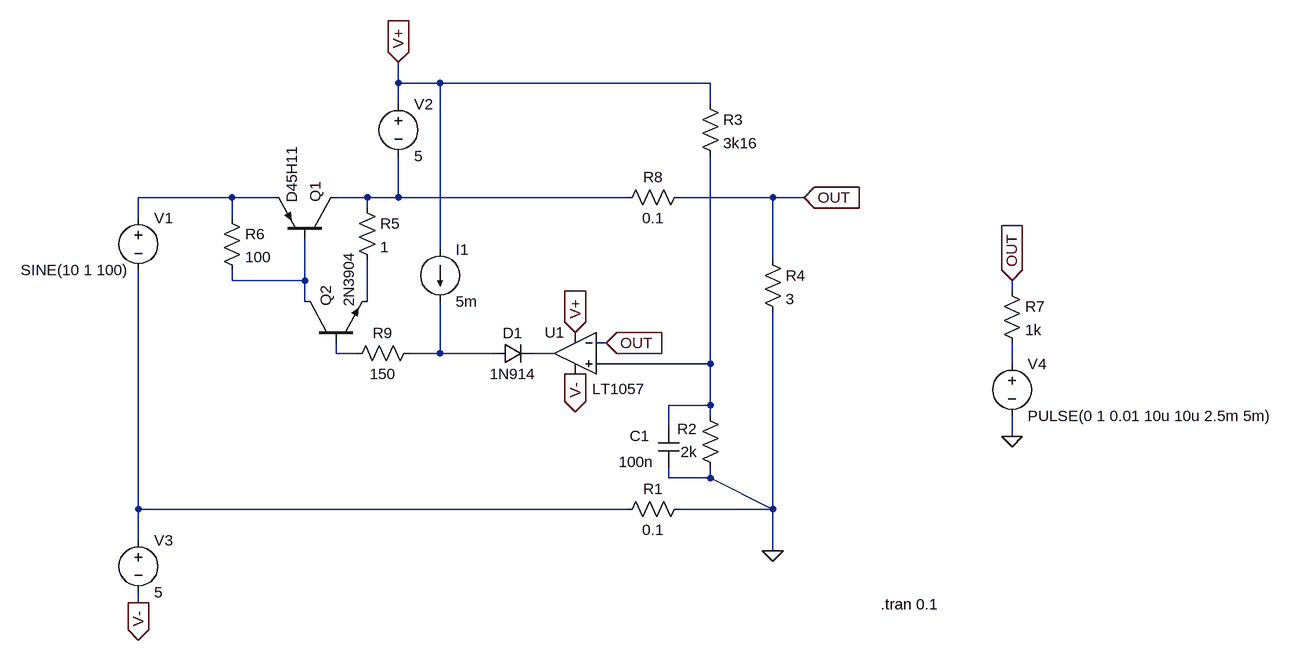
[diagram p0: schematic Draft5.asc]
Draft5.asc, the LTspice schematic file:
Version 4
SHEET 1 1528 1052
WIRE 160 16 160 -16
WIRE 224 16 160 16
WIRE 640 16 224 16
WIRE 160 48 160 16
WIRE 640 48 640 16
WIRE -96 192 -240 192
WIRE -32 192 -96 192
WIRE 112 192 64 192
WIRE 160 192 160 128
WIRE 160 192 112 192
WIRE 512 192 160 192
WIRE 736 192 592 192
WIRE 784 192 736 192
WIRE 112 208 112 192
WIRE -240 224 -240 192
WIRE -96 224 -96 192
WIRE 224 272 224 16
WIRE 736 288 736 192
WIRE -96 320 -96 304
WIRE 16 320 16 256
WIRE 16 320 -96 320
WIRE 1104 336 1104 320
WIRE 16 352 16 320
WIRE 112 352 112 288
WIRE 480 416 464 416
WIRE 64 432 64 416
WIRE 96 432 64 432
WIRE 224 432 224 352
WIRE 224 432 176 432
WIRE 304 432 224 432
WIRE 400 432 368 432
WIRE 640 448 640 128
WIRE 640 448 464 448
WIRE 1104 448 1104 416
WIRE 640 512 640 448
WIRE 640 512 576 512
WIRE 640 528 640 512
WIRE 576 544 576 512
WIRE 1104 560 1104 528
WIRE 576 624 576 608
WIRE 640 624 640 608
WIRE 640 624 576 624
WIRE -240 672 -240 304
WIRE 512 672 -240 672
WIRE 736 672 736 368
WIRE 736 672 640 624
WIRE 736 672 592 672
WIRE -240 720 -240 672
WIRE 736 736 736 672
WIRE -240 816 -240 800
FLAG 736 736 0
FLAG 160 -16 V+
IOPIN 160 -16 In
FLAG -240 816 V-
IOPIN -240 816 Out
FLAG 480 416 OUT
IOPIN 480 416 In
FLAG 784 192 OUT
IOPIN 784 192 In
FLAG 432 400 V+
IOPIN 432 400 In
FLAG 432 464 V-
IOPIN 432 464 Out
FLAG 1104 560 0
FLAG 1104 320 OUT
IOPIN 1104 320 In
SYMBOL voltage -240 208 R0
WINDOW 3 -181 96 Left 2
WINDOW 123 0 0 Left 2
WINDOW 39 0 0 Left 2
SYMATTR InstName V1
SYMATTR Value SINE(10 1 100)
SYMBOL voltage 160 32 R0
WINDOW 123 0 0 Left 2
WINDOW 39 0 0 Left 2
SYMATTR InstName V2
SYMATTR Value 5
SYMBOL res 608 656 R90
WINDOW 0 0 56 VBottom 2
WINDOW 3 32 56 VTop 2
SYMATTR InstName R1
SYMATTR Value 0.1
SYMBOL res 656 624 R180
WINDOW 0 36 76 Left 2
WINDOW 3 36 40 Left 2
SYMATTR InstName R2
SYMATTR Value 2k
SYMBOL res 624 32 R0
SYMATTR InstName R3
SYMATTR Value 3k16
SYMBOL res 720 272 R0
SYMATTR InstName R4
SYMATTR Value 3
SYMBOL pnp 64 256 M270
SYMATTR InstName Q1
SYMATTR Value D45H11
SYMBOL Opamps\\LT1057 432 368 M0
WINDOW 3 -109 119 Left 2
SYMATTR InstName U1
SYMBOL voltage -240 704 R0
WINDOW 123 0 0 Left 2
WINDOW 39 0 0 Left 2
SYMATTR InstName V3
SYMATTR Value 5
SYMBOL diode 304 448 R270
WINDOW 0 32 32 VTop 2
WINDOW 3 0 32 VBottom 2
SYMATTR InstName D1
SYMATTR Value 1N914
SYMBOL current 224 272 R0
WINDOW 123 0 0 Left 2
WINDOW 39 0 0 Left 2
SYMATTR InstName I1
SYMATTR Value 5m
SYMBOL npn 16 416 R270
SYMATTR InstName Q2
SYMATTR Value 2N3904
SYMBOL res 96 192 R0
SYMATTR InstName R5
SYMATTR Value 1
SYMBOL res -112 208 R0
SYMATTR InstName R6
SYMATTR Value 100
SYMBOL voltage 1104 432 R0
WINDOW 123 0 0 Left 2
WINDOW 39 0 0 Left 2
SYMATTR InstName V4
SYMATTR Value PULSE(0 1 0.01 10u 10u 2.5m 5m)
SYMBOL res 1088 320 R0
SYMATTR InstName R7
SYMATTR Value 1k
SYMBOL cap 560 544 R0
WINDOW 0 -44 15 Left 2
WINDOW 3 -61 55 Left 2
SYMATTR InstName C1
SYMATTR Value 100n
SYMBOL res 608 176 R90
WINDOW 0 0 56 VBottom 2
WINDOW 3 32 56 VTop 2
SYMATTR InstName R8
SYMATTR Value 0.1
SYMBOL res 192 416 R90
WINDOW 0 0 56 VBottom 2
WINDOW 3 32 56 VTop 2
SYMATTR InstName R9
SYMATTR Value 150
TEXT 902 818 Left 2 !.tran 0.1

The netlist it stands for:
* Draft5.asc
V1 N001 N010 SINE(10 1 100)
V2 V+ N002 5
R1 0 N010 0.1
R2 0 N008 2k
R3 V+ N008 3k16
R4 OUT 0 3
Q1 N002 N003 N001 0 D45H11
XU1 N008 OUT V+ V- N007 LT1057  ; pins In+ In- V+ V- OUT
V3 N010 V- 5
D1 N006 N007 1N914
I1 V+ N006 5m
Q2 N003 N005 N004 0 2N3904
R5 N002 N004 1
R6 N001 N003 100
V4 N009 0 PULSE(0 1 0.01 10u 10u 2.5m 5m)
R7 OUT N009 1k
C1 N008 0 100n
R8 OUT N002 0.1
R9 N006 N005 150
.model D D
.lib standard.dio
.model NPN NPN
.model PNP PNP
.lib standard.bjt
.tran 0.1
.lib LTC.lib
.backanno
.end